# Altium schematic sheet Panels.SchDoc
size 420 x 297 mm; SheetNumber: 3; SheetTotal: 21
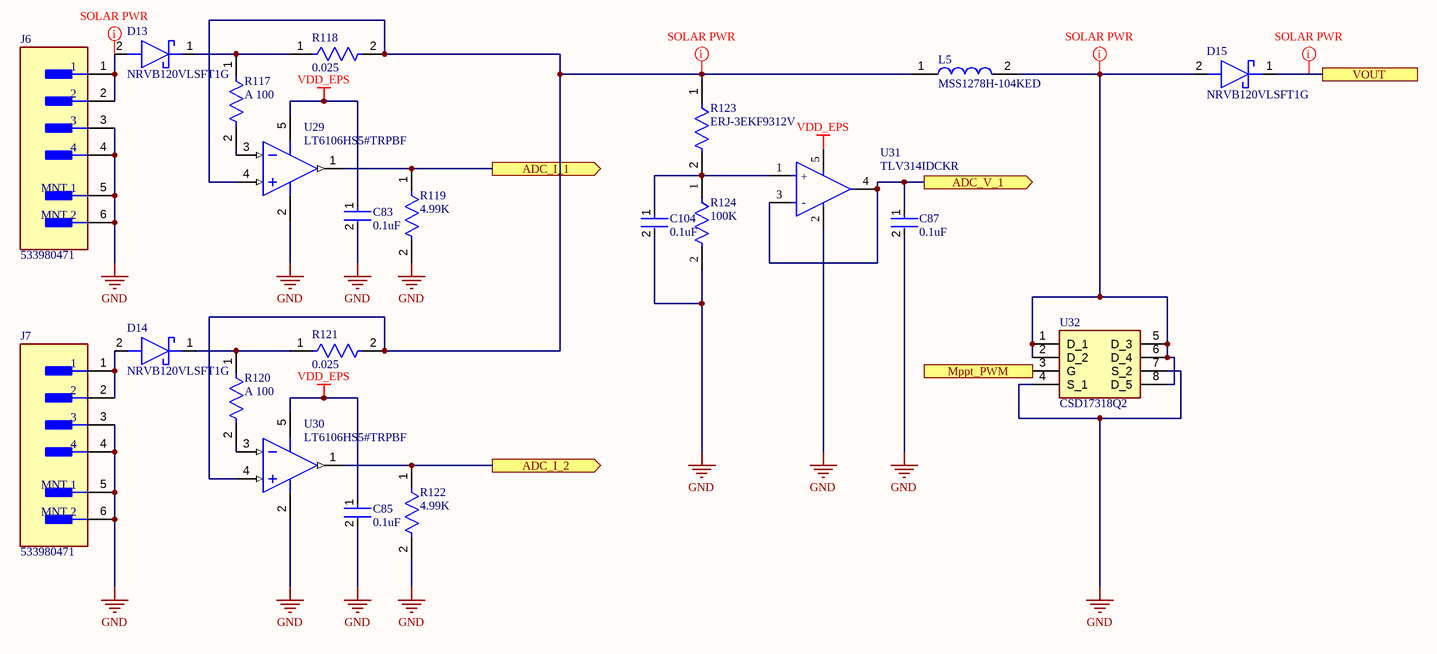
[diagram p0: Panels.SchDoc]

## Parts
C83  0.1uF  [FP-C0603C-CF-MFG]
C85  0.1uF  [FP-C0603C-CF-MFG]
C87  0.1uF  [FP-C0603C-CF-MFG]
C104  0.1uF  [FP-C0603C-CF-MFG]
D13  NRVB120VLSFT1G  [SODFL3616X98N]
D14  NRVB120VLSFT1G  [SODFL3616X98N]
D15  NRVB120VLSFT1G  [SODFL3616X98N]
J6  533980471  [FP-533980471-MFG]
J7  533980471  [FP-533980471-MFG]
L5  MSS1278H-104KED  [INDPM120120X805N]
R117  A 100  [FP-ERA3A-IPC_B]
R118  0.025  [FP-PRL0816-MFG]
R119  4.99K  [FP-ERA3A-IPC_C]
R120  A 100  [FP-ERA3A-IPC_B]
R121  0.025  [FP-PRL0816-MFG]
R122  4.99K  [FP-ERA3A-IPC_C]
R123  ERJ-3EKF9312V  [FP-ERJ3EK-IPC_C]
R124  100K  [FP-ERA3A-MFG]
U29  LT6106HS5#TRPBF  [LT-S5-5-TSOT-23_M]
U30  LT6106HS5#TRPBF  [LT-S5-5-TSOT-23_M]
U31  TLV314IDCKR  [FP-DCK0005A-MFG]
U32  CSD17318Q2  [CSD17318Q2]

## Ports
ADC_I_1 (out), ADC_I_2 (out), ADC_V_1 (out), Mppt_PWM (in), VOUT

## Nets
GND: C83.2 C85.2 C87.2 C104.2 J6.3 J6.4 J6.5(MNT_1) J6.6(MNT_2) J7.3 J7.4 J7.5(MNT_1) J7.6(MNT_2) R119.2 R122.2 R124.2 U29.2(V-) U30.2(V-) U31.2(V-) U32.4(S_1) U32.7(S_2)
VDD_EPS: C83.1 C85.1 U29.5(V+) U30.5(V+) U31.5(V+)
ADC_I_1: R119.1 U29.1(OUT) ; port ADC_I_1
ADC_I_2: R122.1 U30.1(OUT) ; port ADC_I_2
ADC_V_1: C87.1 U31.3(-IN) U31.4(OUT) ; port ADC_V_1
Mppt_PWM: U32.3(G) ; port Mppt_PWM
VOUT: D15.1(K) ; port VOUT
NetC104_1: C104.1 R123.2 R124.1 U31.1(+IN)
NetD13_1: D13.1(K) R117.1 R118.1
NetD13_2: D13.2(A) J6.1 J6.2
NetD14_1: D14.1(K) R120.1 R121.1
NetD14_2: D14.2(A) J7.1 J7.2
NetD15_2: D15.2(A) L5.2 U32.1(D_1) U32.2(D_2) U32.5(D_3) U32.6(D_4) U32.8(D_5)
NetL5_1: L5.1 R118.2 R121.2 R123.1 U29.4(+IN) U30.4(+IN)
NetR117_2: R117.2 U29.3(-IN)
NetR120_2: R120.2 U30.3(-IN)

## Layout directives
net class SOLAR PWR: NetD13_2, NetD15_2, NetL5_1, VOUT

## Notes on the sheet
- THIS DOCUMENT AND THE DATA DISCLOSED HEREIN OR
- HEREWITH IS THE PROPERTY OF ALTIUM LIMITED AND MAY
- DWG NO:
- REVISION
- REV:
- DESCRIPTION
- DATE
- APPROVED
- BE FREELY DISTRIBUTED IN WHOLE. NO RIGHTS ARE
- RESERVED OR EXPRESS OR IMPLIED WARANTEE GIVEN.
- ENG:
- APPROVALS
- PROJECT
- DSN:
- CHK:
- REFERENCE DOCUMENTS
- PROJECT REVISION:
- TITLE
- DOCUMENT REVISION:
- DESIGN ITEM:
- BOM:
- FAB DWG:
- PCB DWG:
- ASSY DWG:
- SCALE:
- A3
- SIZE
- CAGE CODE
- FILE NAME
- DWG NO.
- SHEET
- OF
- REV
- (in symbol CMP-04895-000170-1) +; -

## Library data of the parts
C83 C85 C87 C104 = CMP-2006-03061-2: CAP CER 0.1UF 50V X7R 0603; Manufacturer: KEMET; Manufacturer Part Number: C0603C104K5RACTU; Tolerance: 0.1; Temperature Coefficient: 30ppm/°C; Material: Ceramic; Automotive Grade: Grade 1; Value: 0.10 μF; Temperature: -55°C to +125°C; RoHS: TRUE; Temperature Range High: +125°C; Lead Free: Yes; Octopart: https://octopart.com/c0603c104k5ractu-kemet-139244; Digikey Description: CAP CER 0.1UF 50V X7R 0603; Category: Cap; Package: C0603C-CF; ComponentLink2Description: Datasheet; Temperature Range Low: -55°C; Device Class L1: Passive Components; Voltage Rating: 50 V; Automotive: Yes; Device Class L3: Ceramic Capacitors; ComponentLink2URL: https://api.kemet.com/component-edge/download/datasheet/C0603C100J5GACAUTO.pdf; Capacitance: 0.10 μF; Device Class L2: Capacitors; Temperature Characteristic: X7R; Height: 0.87mm
D13-D15 = NRVB120VLSFT1G: Schottky Diode; Manufacturer_Name: onsemi; Datasheet Link: https://www.onsemi.com/pub/Collateral/MBR120VLSFT1-D.PDF; Height: 0.98mm; Manufacturer_Part_Number: NRVB120VLSFT1G; Mouser Part Number: 863-NRVB120VLSFT1G; Mouser Price/Stock: https://www.mouser.co.uk/ProductDetail/onsemi/NRVB120VLSFT1G?qs=tCMd4XlZ%2FiDc2vkUzw3hig%3D%3D; Arrow Part Number: NRVB120VLSFT1G; Arrow Price/Stock: null?utm_currency=USD&region=nac
J6 J7 = CMP-04776-000105-1: CONN HEADER SMD 4POS 1.25MM; Manufacturer: Molex; Conn Gender: Male; Conn Orientation: Vertical; Standoff Height: 0.05mm; Number Of Contacts: 4; Current Rating: 1A; Voltage Rating: 125V; Package: 0; ComponentLink2Description: Datasheet; ComponentLink2URL: https://www.molex.com/pdm_docs/ps/PS-51021-024-001.pdf; Ambient Temperature Range Low: -40°C; Category: Conn; Automotive: No; Number Of Rows: 1; Device Class L3: unset; Ambient Temperature Range High: +105°C; Height: 5.1mm; Lead Free: Yes; Pitch: 1.25mm; Contact Material: Tin; Footprint Url: https://www.molex.com/pdm_docs/sd/533980471_sd.pdf; Octopart: https://octopart.com/53398-0471-molex-655296; Temperature Range Low: -40°C; Device Class L2: Headers and Wire Housings; Temperature: -40°C to +105°C; Digikey Description: CONN HEADER SMD 4POS 1.25MM; RoHS: TRUE; Manufacturer Part Number: 533980471; Device Class L1: Connectors; Temperature Range High: +105°C
L5 = CMP-006-00046-2: Fixed Inductors 100uH Shld 2.3A 10% DCR-121mOhmsAEC-Q200; Manufacturer_Name: COILCRAFT; Height: 8.05mm; Source: SamacSys.SchLib; Manufacturer_Part_Number: MSS1278H-104KED; Mouser Price/Stock: https://www.mouser.co.uk/ProductDetail/Coilcraft/MSS1278H-104KED?qs=KUoIvG%2F9IlbXnL7JW4S4%2FA%3D%3D; Design Item ID: MSS1278H-104KED; Datasheet Link: https://www.coilcraft.com/getmedia/72ffd561-3941-457d-b0e7-bb55b1b2d1a7/MSS1278H.pdf; Mouser Part Number: 994-MSS1278H-104KED
R117 R120 = CMP-2000-00870-2: RES SMD 100 OHM 0.1% 1/10W 0603; Voltage Rating: 75V; Power Rating: 100mW; Resistance: 100R; Temperature Coefficient: 25ppm/°C; Number of Terminations: 2; Case/Package: 0603; Termination: SMD/SMT; Number of Pins: 2; Size Code: 0603; Length: 1.6mm; Min Operating Temperature: -55°C; Resistor Type: Thin Film; Depth: 0.8mm; Military Standard: Not; Packaging: Tape and Reel; RoHS Compliant: Yes; Construction: Rectangular; Resistance Tolerance: 0.1%; Contact Plating: Tin; Width: 0.8mm; Mount: Surface Mount; Case Code (Metric): 1608; Max Operating Temperature: 155°C; Height: 0.45mm; Case Code (Imperial): 0603; Series: ERA-3A; Package Quantity: 5000; REACH SVHC: No SVHC; Tolerance: 0.1%; Max Power Dissipation: 100mW; Radiation Hardening: No; Technology: METAL FILM
R118 R121 = CMP-28537-000948-1: 25 mOhms ±1% 0.33W Chip Resistor Wide 0306 (0816 Metric), Current Sense Thin Film; Temperature Coefficient: 200ppm/°C; Resistance: 25mR; Power Rating: 330mW; Tolerance: 1%; Case Code (Metric): 0816; Packaging: Tape and Reel; RoHS Compliant: Yes; Height: 0.4mm; Termination: SMD/SMT; Case Code (Imperial): 0306; Technology: THIN FILM; Package Quantity: 1000; Length: 1.6mm; Width: 0.8mm; Series: PRL
R119 R122 = CMP-2000-00077-5: RES SMD 4.99KOHM 0.1% 1/10W 0603; Voltage Rating (DC): 75V; Max Power Dissipation: 100mW; Temperature Coefficient: 25ppm/°C; Resistance: 4.99kR; Voltage Rating: 150V; Features: Automotive AEC-Q200; Depth: 0.8mm; Case Code (Imperial): 0603; Resistance Tolerance: 0.1%; Mount: Surface Mount; Contact Plating: Tin; Length: 1.6mm; RoHS Compliant: Yes; Termination: SMD/SMT; Width: 0.8mm; Case/Package: 0603; Series: ERA; Radiation Hardening: No; Tolerance: 0.1%; Lead Free: Lead Free; Technology: METAL FILM; Construction: Rectangular; Number of Terminations: 2; Weight: 7.1E-05oz; Power Rating: 100mW; Number of Pins: 2; Min Operating Temperature: -55°C; Height: 0.45mm; Case Code (Metric): 1608; Package Quantity: 5000; Military Standard: Not; Max Operating Temperature: 155°C; Resistor Type: Thin Film; Reach SVHC Compliant: Yes; Packaging: Tape and Reel
R123 = CMP-2000-00690-5: RES SMD 93.1K OHM 1% 1/10W 0603; Resistance: 93.1kR; Temperature Coefficient: 100ppm/°C; Voltage Rating (DC): 50V; Voltage Rating: 75V; Power Rating: 100mW; Radiation Hardening: No; Series: ERJ; Tolerance: 1%; Packaging: Tape and Reel; Lead Free: Lead Free; Weight: 7.1E-05oz; Features: Automotive AEC-Q200; Resistor Type: Thick Film; Reach SVHC Compliant: Yes; Mount: Surface Mount; Military Standard: Not; Package Quantity: 1; RoHS Compliant: Yes; Case/Package: 0603; Contact Plating: Tin; Termination: SMD/SMT; Length: 1.6mm; Case Code (Metric): 1608; Max Operating Temperature: 155°C; Resistance Tolerance: 1%; Height: 0.022inch; Depth: 0.8mm; Construction: Rectangular; Max Power Dissipation: 100mW; Width: 0.8mm; Number of Terminations: 2; Min Operating Temperature: -55°C; Case Code (Imperial): 0603
R124 = CMP-2000-00875-2: NexarPartId: 1243428; Power Rating: 100mW; Voltage Rating (DC): 75V; Tolerance: 0.1%; Temperature Coefficient: 25ppm/°C; Resistance: 100kΩ; Contact Plating: Tin; Max Operating Temperature: 155°C; Case Code (Imperial): 0603; Packaging: Cut Tape; Width: 800µm; Lead Free: Lead Free; REACH SVHC: No SVHC; Termination: SMD/SMT; Radiation Hardening: No; Length: 1.6mm; Military Standard: Not; Features: Automotive AEC-Q200; Case/Package: 0603; Number of Terminations: 2; Composition: Thin Film; Schedule B: 8533210045, 8533210045; Voltage Rating: 75V; Mount: Surface Mount; Case Code (Metric): 1608; Lifecycle Status: Production; Height: 450µm; RoHS: Compliant; Number of Pins: 2; Max Power Dissipation: 100mW; Min Operating Temperature: -55°C; Depth: 800µm; Working Voltage: 75V
U29 U30 = CMP-0359-01984-2: Single Channel, Low Cost, High Side Current Sense Operational Amplifier, 0.2 MHz Typical GBW, 5-Pin SOT-23 (S5-5), High Temperature / Automotive, Pb-Free, Reel; Manufacturer: Linear Technology; Linear Technology Part Number: LT6106; Vos (mV) Typical: 0.15; Vs Min (V): 2.7; Vs Max (V): 36; Is (mA) Typical: 0.06; Vos (mV) Guaranteed: 0.25; Channels (#): 1; GBW (MHz) Typical: 0.2; PackageDescription: 5-Lead Plastic TSOT-23, Body 1.63 x 2.90 mm, Pitch 0.95 mm; ComponentLink3Description: Package Specification; Mounting Technology: Surface Mount; Type: CSA; RevisionNote: URLs updated; ComponentLink2URL: http://cds.linear.com/docs/en/datasheet/6106fa.pdf; ComponentLink1URL: http://www.linear.com/; Code_JEDEC: MO-193; PartNumber: LT6106HS5#TRPBF; Packing: Reel; DatasheetVersion: Rev. A; RoHS: Pb-Free; ComponentLink3URL: http://cds.linear.com/docs/en/packaging/SOT_5_05-08-1635.pdf; ComponentLink1Description: Manufacturer URL; PackageReference: LT-S5-5-TSOT-23; ComponentLink2Description: Datasheet
U31 = CMP-04895-000170-1: IC CMOS 1 CIRCUIT SC70-5; Gain Bandwidth Product: 3MHz; Number of Channels: 1; Lead Free: Lead Free; Min Operating Temperature: -40°C; RoHS Compliant: Yes; Max Operating Temperature: 125°C; Number of Pins: 5
U32 = CSD17318Q2: Integrated Circuit; Manufacturer_Name: Texas Instruments; Datasheet Link: https://www.ti.com/lit/ds/symlink/csd17318q2.pdf?ts=1704287484498&ref_url=https%253A%252F%252Fwww.ti.com%252Fproduct%252FCSD17318Q2; Height: 0.8mm; Manufacturer_Part_Number: CSD17318Q2; Mouser Part Number: 595-CSD17318Q2; Mouser Price/Stock: https://www.mouser.co.uk/ProductDetail/Texas-Instruments/CSD17318Q2?qs=HXFqYaX1Q2yFLkhHL33iLQ%3D%3D; Arrow Part Number: CSD17318Q2; Arrow Price/Stock: https://www.arrow.com/en/products/csd17318q2/texas-instruments?utm_currency=USD&region=nac